# EAGLE design coreboard (EAGLE 6.5.0)
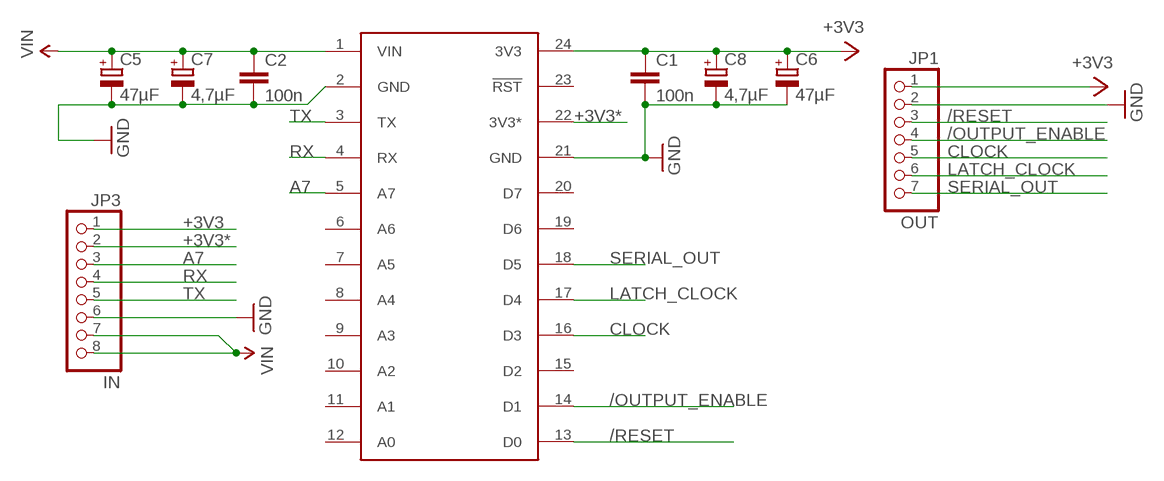
[diagram p0: schematic, sheet 1]

## Parts
C1  100n  C-EU025-024X044  [C025-024X044]
C2  100n  C-EU025-024X044  [C025-024X044]
C5  47µF  CPOL-EUE2.5-7  [E2,5-7]
C6  47µF  CPOL-EUE2.5-7  [E2,5-7]
C7  4,7µF  CPOL-EUE2.5-5  [E2,5-5]
C8  4,7µF  CPOL-EUE2.5-5  [E2,5-5]
JP1  OUT  PINHD-1X7  [1X07]
JP3  IN  PINHD-1X8  [1X08]
U$1  SPARK_CORECORE  [SPARK_CORE]

## Nets
+3V3: C1.1 C6.+ C8.+ JP1.1 JP3.1 U$1.24(3V3)
+3V3*: JP3.2 U$1.22(3V3*)
/OUTPUT_ENABLE: JP1.4 U$1.14(D1)
/RESET: JP1.3 U$1.13(D0)
A7: JP3.3 U$1.5(A7)
CLOCK: JP1.5 U$1.16(D3)
GND: C1.2 C2.2 C5.- C6.- C7.- C8.- JP1.2 JP3.6 U$1.2(GND) U$1.21(GND)
LATCH_CLOCK: JP1.6 U$1.17(D4)
RX: JP3.4 U$1.4(RX)
SERIAL_OUT: JP1.7 U$1.18(D5)
TX: JP3.5 U$1.3(TX)
VIN: C2.1 C5.+ C7.+ JP3.7 JP3.8 U$1.1(VIN)
Unconnected: U$1.6(A6) U$1.7(A5) U$1.8(A4) U$1.9(A3) U$1.10(A2) U$1.11(A1) U$1.12(A0) U$1.15(D2) U$1.19(D6) U$1.20(D7) U$1.23(!RST)

## Library data of the parts
C1 C2 = rcl:C-EU: CAPACITOR, European symbol
C5-C8 = rcl:CPOL-EU: POLARIZED CAPACITOR, European symbol
JP1 = pinhead:PINHD-1X7: PIN HEADER
JP3 = pinhead:PINHD-1X8: PIN HEADER
U$1 = Spark:SPARK_CORE

## Board
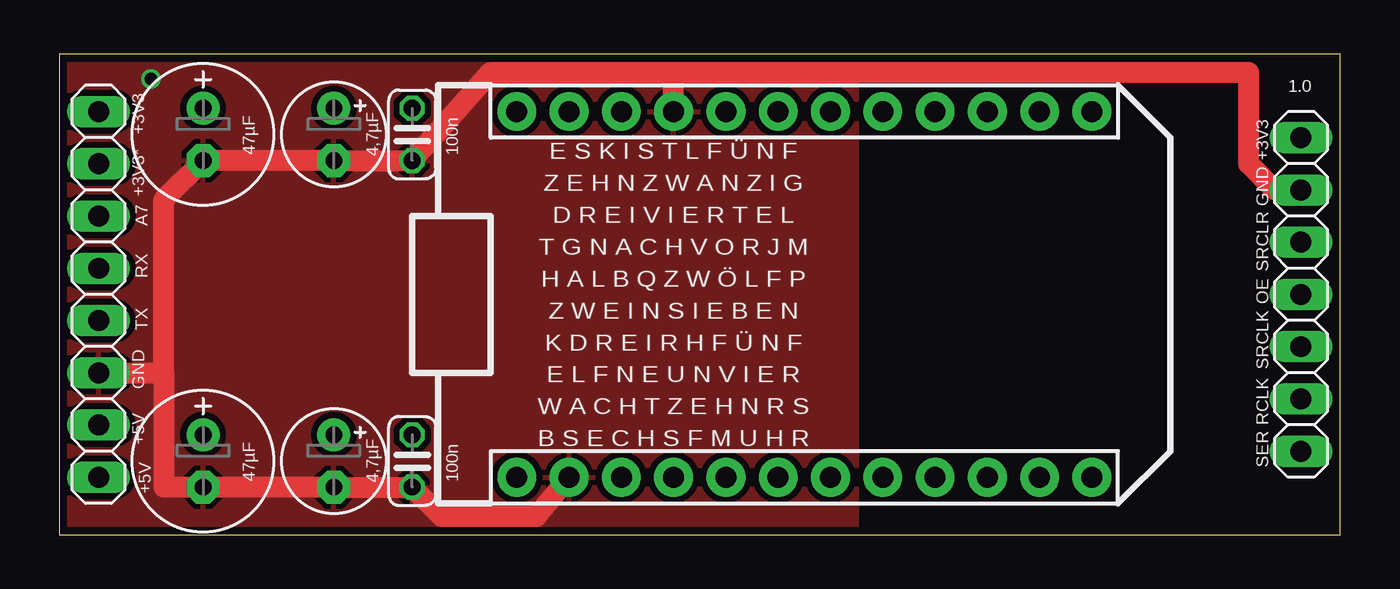
[diagram p1: board, top side]
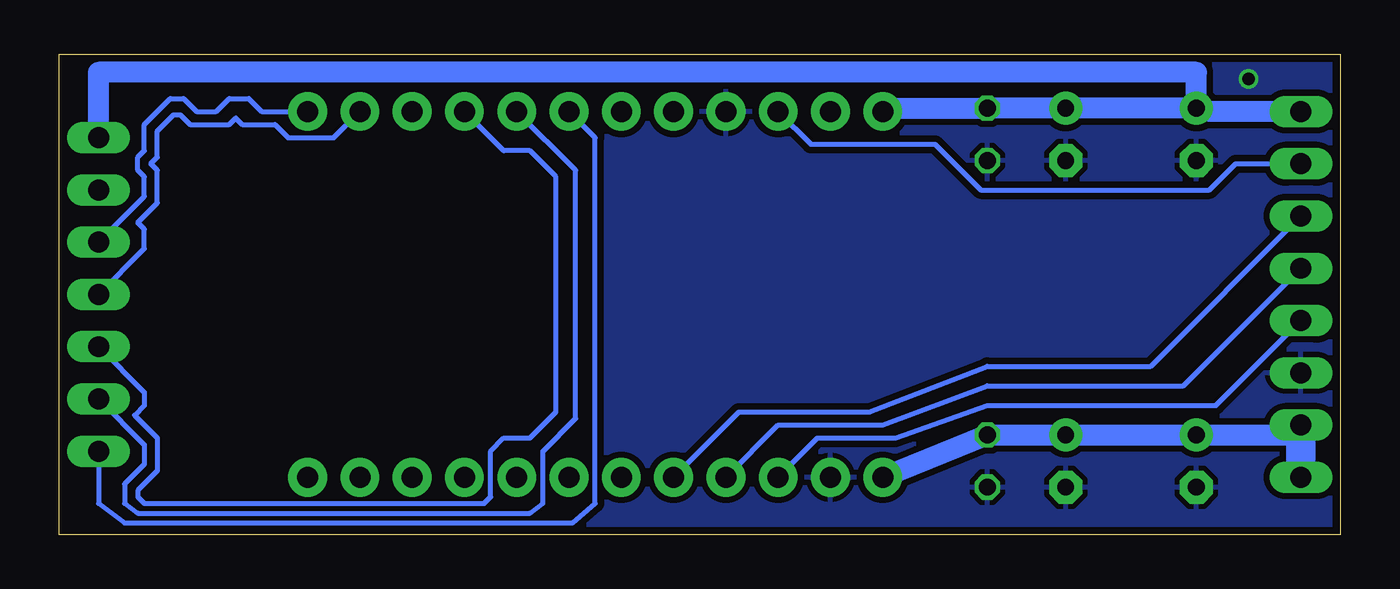
[diagram p2: board, bottom side, seen from below]

Size 62.23 x 23.37 mm. Coordinates in mm from the lower left corner, seen from the top.
Outline: 0,0 62.23,0 62.23,23.37 0,23.37 0,0
Copper layers (1*16): Top 0.0356mm / dielectric 1.5011mm / Bottom 0.0356mm
Design rules "laenPCBOrder": minimum track width 6mil, minimum drill 13mil, track to track 6mil, track to pad 6mil, pad to pad 6mil, via to via 6mil, smd to smd 6mil, copper to edge 15mil, drill to drill 6mil, minimum pad ring 7mil, minimum via ring 7mil, stop-mask expansion 3mil, vias tented up to drill 0mil, thermal gap 10mil

### Footprints (pad centres in the part's own frame; a part is rotated, then mirrored left to right if it is on the bottom)
C025-024X044 = drill 0.813 octagon: 1 -1.27,0; 2 1.27,0
E2,5-7 = drill 0.813 pad 1.6: + -1.27,0 | drill 0.813 pad 1.6 octagon: - 1.27,0
E2,5-5 = drill 0.813 pad 1.6: + -1.27,0 | drill 0.813 pad 1.6 octagon: - 1.27,0
1X07 = drill 1.016 long: 1 -7.62,0; 2 -5.08,0; 3 -2.54,0; 4 0,0; 5 2.54,0; 6 5.08,0; 7 7.62,0
1X08 = drill 1.016 long: 1 -8.89,0; 2 -6.35,0; 3 -3.81,0; 4 -1.27,0; 5 1.27,0; 6 3.81,0; 7 6.35,0; 8 8.89,0
SPARK_CORE = drill 1.016 pad 1.88: 1 -8.89,13.97; 2 -8.89,11.43; 3 -8.89,8.89; 4 -8.89,6.35; 5 -8.89,3.81; 6 -8.89,1.27; 7 -8.89,-1.27; 8 -8.89,-3.81; 9 -8.89,-6.35; 10 -8.89,-8.89; 11 -8.89,-11.43; 12 -8.89,-13.97; 13 8.89,-13.97; 14 8.89,-11.43; 15 8.89,-8.89; 16 8.89,-6.35; 17 8.89,-3.81; 18 8.89,-1.27; 19 8.89,1.27; 20 8.89,3.81; 21 8.89,6.35; 22 8.89,8.89; 23 8.89,11.43; 24 8.89,13.97

### Placement (x,y rotation side)
C1  17.14,19.46 270 top
C2  17.14,3.59 270 top
C5  6.98,3.59 270 top
C6  6.98,19.46 270 top
C7  13.34,3.59 270 top
C8  13.34,19.46 270 top
JP1  60.32,11.68 270 top
JP3  1.9,11.68 270 top
U$1  36.2,11.68 90 top

### Tracks (layer width: path | path; a pad name or v marks a point on that pad's centre or on a via)
+3V3
  Bottom 1.016: JP1.1 60.32,22.48 6.98,22.48 C6.+ | JP3.1 6.35,20.57 C6.+ | C6.+ C8.+ C1.1 22.07,20.73 U$1.24
+3V3*
  Bottom 0.254: U$1.22 25.72,18.99 19.68,18.99 17.46,16.76 6.35,16.76 5.08,18.03 JP3.2
/OUTPUT_ENABLE
  Bottom 0.254: JP1.4 58.1,13.91 58.1,14.86 58.42,15.18 57.47,16.13 57.47,17.72 57.78,18.03 57.47,18.35 57.47,19.62 56.67,20.41 56.36,20.41 55.88,19.94 53.98,19.94 53.66,20.26 53.34,19.94 51.75,19.94 51.12,19.3 48.9,19.3 U$1.14
/RESET
  Bottom 0.254: JP1.3 58.1,16.45 58.1,17.4 58.42,17.72 58.42,18.35 58.1,18.67 58.1,19.94 56.83,21.21 56.2,21.21 55.56,20.57 54.61,20.57 53.98,21.21 53.02,21.21 52.39,20.57 U$1.13
A7
  Bottom 0.254: U$1.5 29.21,5.97 22.86,5.97 17.14,8.19 9.21,8.19 JP3.3
CLOCK
  Bottom 0.254: JP1.5 58.1,6.92 58.1,6.29 58.58,5.81 57.47,4.7 57.47,3.11 58.42,2.16 58.42,1.84 58.1,1.52 41.59,1.52 41.27,1.84 41.27,4.06 40.64,4.7 39.37,4.7 38.1,5.97 38.1,17.4 39.37,18.67 40.64,18.67 U$1.16
GND  (via drill 0.6)
  Top 1.016: JP3.6 5.08,7.87 | 5.08,7.87 5.08,2.32 C5.- C7.- C2.2 18.57,0.89 23.18,0.89 U$1.2 | 29.84,22.48 20.95,22.48 C1.2 C8.- C6.- 5.08,16.29 5.08,7.87 | 29.84,22.48 57.78,22.48 57.78,18.03 59.05,16.76 JP1.2 | U$1.21 29.84,22.48
  other vias: 4.45,22.16
  pour Top (isolate 0.305): 0,23.43 38.73,23.43 38.73,-0.06 0,-0.06
  pour Bottom (isolate 0.305): 0,23.43 38.73,23.43 38.73,-0.06 0,-0.06
LATCH_CLOCK
  Bottom 0.254: JP1.6 58.1,4.38 58.1,3.43 59.05,2.48 59.05,1.52 58.42,1.05 39.37,1.05 38.73,1.52 38.73,4.06 37.15,5.65 37.15,17.72 U$1.17
RX
  Bottom 0.254: U$1.4 27.3,5.33 22.23,5.33 17.14,7.24 7.62,7.24 JP3.4
SERIAL_OUT
  Bottom 0.254: JP1.7 60.32,1.52 59.05,0.57 37.31,0.57 36.2,1.52 36.2,19.3 U$1.18
TX
  Bottom 0.254: U$1.3 25.4,4.7 21.59,4.7 17.14,6.29 6.03,6.29 JP3.5
VIN
  Bottom 1.016: U$1.1 C2.1 C7.+ C5.+ 1.9,4.86 JP3.7
  Bottom 1.422: JP3.8 JP3.7

### Text on the board
tPlace: 1.0 | +3V3 | +3V3 | +3V3* | GND | A7 | SRCLR | RX | E S K I S T L F Ü N F / Z E H N Z W A N Z I G / D R E I V I E R T E L / T G N A C H V O R J M / H A L B Q Z W Ö L F P / Z W E I N S I E B E N / K D R E I R H F Ü N F / E L F N E U N V I E R / W A C H T Z E H N R S / B S E C H S F M U H R | OE | TX | SRCLK | GND | RCLK | +5V | SER | +5V